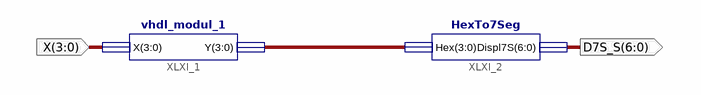
[diagram p0: schematic sheet 1]
// Xilinx ISE schematic schematic_modul_1.sch (xc9500xl) as structural Verilog: 2 symbols, 2 ports
module schematic_modul_1 (
  input  [3:0] X,
  output [6:0] D7S_S
);

  wire [3:0] XLXN_2;

  vhdl_modul_1 XLXI_1 (.X(X), .Y(XLXN_2));
  HexTo7Seg XLXI_2 (.Hex(XLXN_2), .Displ7S(D7S_S));
endmodule
